# Altium project max5025.PrjPCB
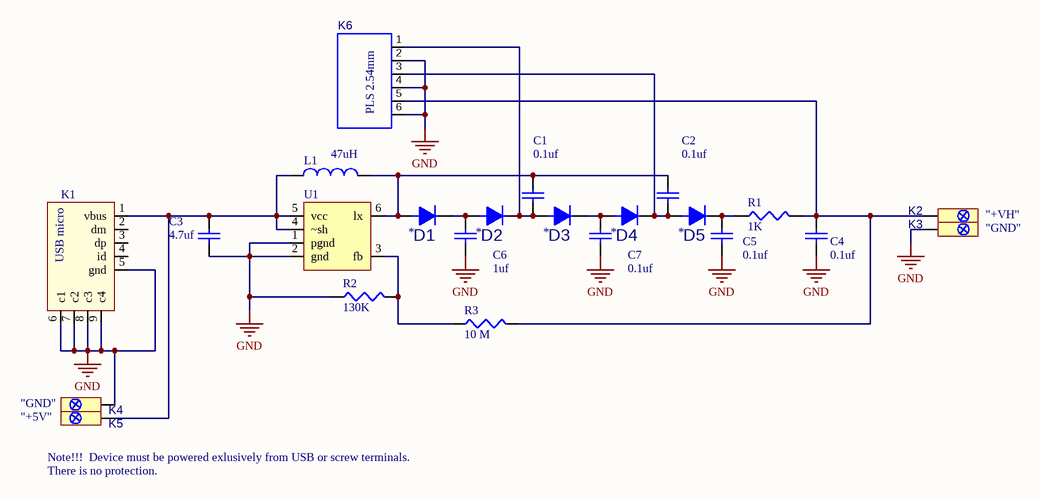
[diagram p0: max5025.SchDoc]
1 sheet, 23 parts. Net scope: global (net labels, ports and power ports of the same name join across sheets).
Board file: max5025.PcbDoc

## Sheet max5025.SchDoc
size A4

### Parts
C1  value 0.1uf  [SM1206]  (hidden comment: cap1206)
C2  value 0.1uf  [SM1206]  (hidden comment: cap1206)
C3  value 4.7uf  [SM1206]  (hidden comment: cap1206)
C4  value 0.1uf  [SM1206]  (hidden comment: cap1206)
C5  value 0.1uf  [SM1206]  (hidden comment: cap1206)
C6  value 1uf  [SM1206]  (hidden comment: cap1206)
C7  value 0.1uf  [SM1206]  (hidden comment: cap1206)
D1  Diode  [SM1206_diode]  (value not drawn)
D2  Diode  [SM1206_diode]  (value not drawn)
D3  Diode  [SM1206_diode]  (value not drawn)
D4  Diode  [SM1206_diode]  (value not drawn)
D5  Diode  [SM1206_diode]  (value not drawn)
K1  USB_micro  [USB_micro]  (value not drawn)
K2  SCREW_1  [SCREW_CON_8.1mm]  (value not drawn)
K3  SCREW_1  [SCREW_CON_8.1mm]  (value not drawn)
K4  SCREW_1  [SCREW_CON_8.1mm]  (value not drawn)
K5  SCREW_1  [SCREW_CON_8.1mm]  (value not drawn)
K6  2x3_PLS_2.54mm  [2x3 pin 2.54mm]  (value not drawn)
L1  inductance SMT 3.2x4.5 mm  [inductor_LQH43PN]  (value not drawn)
R1  value 1K  [SM0805]  (hidden comment: res0805)
R2  value 130K  [SM0805]  (hidden comment: res0805)
R3  value 10 M  [SM0805]  (hidden comment: res0805)
U1  boost conv  [SOT-23_6]  (value not drawn)

### Nets
GND: C3.1 C4.1 C5.1 C6.1 C7.1 K1.5(gnd) K1.6(c1) K1.7(c2) K1.8(c3) K1.9(c4) K3.1 K4.1 K6.2 K6.4 K6.6 R2.1 U1.1(pgnd) U1.2(gnd)
NetC1_1: C1.1 D2.2(k) D3.1(a) K6.1
NetC1_2: C1.2 C2.2 D1.1(a) L1.2 U1.6(lx)
NetC2_1: C2.1 D4.2(k) D5.1(a) K6.3
NetC3_2: C3.2 K1.1(vbus) K5.1 L1.1 U1.4(~sh) U1.5(vcc)
NetC4_2: C4.2 K2.1 K6.5 R1.2 R3.2
NetC5_2: C5.2 D5.2(k) R1.1
NetC6_2: C6.2 D1.2(k) D2.1(a)
NetC7_2: C7.2 D3.2(k) D4.1(a)
NetR2_2: R2.2 R3.1 U1.3(fb)

Not connected (* = marked no-connect by the designer): K1 2(dm) 3(dp) 4(id)

### Notes on the sheet
- "GND"
- "+VH"
- "+5V"
- Note!!!  Device must be powered exlusively from USB or screw terminals.
- There is no protection.
- (in symbol 2x3_PLS_2.54mm) PLS 2.54mm
- (in symbol inductor_LQH43PN) 47uH
- (in symbol USB_micro) USB micro

### Library data of the parts
C1-C7 = cap1206: Capacitor; Published: 8-Jun-2000; LatestRevisionDate: 17-Jul-2002; LatestRevisionNote: Re-released for DXP Platform.; PackageReference: RAD-0.3; Publisher: Altium Limited; PackageDescription: Radial Cap, Thru-Hole; 2 Leads; 0.3 in Pin Spacing
K1 = USB_micro: Sunrom
K6 = 2x3_PLS_2.54mm: 6 pin vertical 2x3 2.54mm; Value: *
L1 = inductor_LQH43PN
R1-R3 = res0805: Resistor; Published: 8-Jun-2000; LatestRevisionDate: 29-May-2009; LatestRevisionNote: IPC-7351 Footprint Added.; PackageReference: J1-0603; Publisher: Altium Limited; PackageDescription: Chip Resistor
U1 = MAX5025_sot23_6
D1-D5 = Diode: Value: *
K2-K5 = SCREW_1: Value: *